# EAGLE schematic ir_transmitter (EAGLE 6.1)
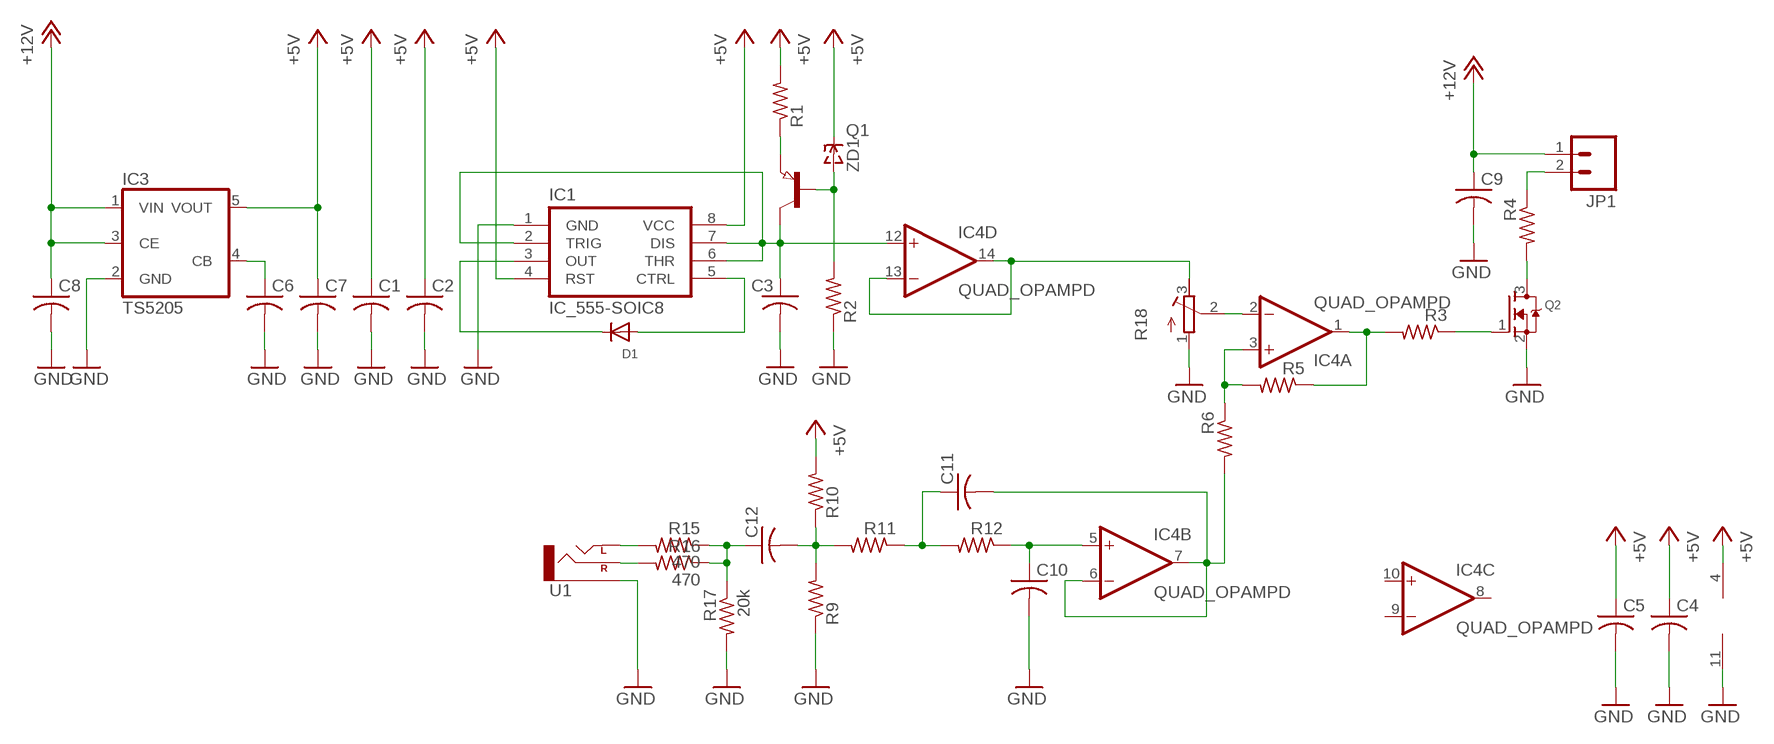
[diagram p0: schematic, sheet 1]

## Parts
C1  C-USC1206  [C1206]
C2  C-USC1206  [C1206]
C3  C-USC1206  [C1206]
C4  C-USC1206  [C1206]
C5  C-USC1206  [C1206]
C6  C-USC1206  [C1206]
C7  C-USC1206  [C1206]
C8  C-USC1206  [C1206]
C9  C-USC1206  [C1206]
C10  C-USC1206  [C1206]
C11  C-USC1206  [C1206]
C12  C-USC1206  [C1206]
D1  DIODESOD-123  [SOD-123]
IC1  IC_555-SOIC8  [SOIC-8]
IC3  TS5205  [SOT25]
IC4  QUAD_OPAMPD  [SO14]
JP1  M02POLAR  [MOLEX-1X2]
Q1  PNP-TRANSISTOR_SOT23  [SOT23]
Q2  MOSFET-NREFLOW  [SOT23]
R1  R-US_M1206  [M1206]
R2  R-US_M1206  [M1206]
R3  R-US_M1206  [M1206]
R4  R-US_M1206  [M1206]
R5  R-US_M1206  [M1206]
R6  R-US_M1206  [M1206]
R9  R-US_M1206  [M1206]
R10  R-US_M1206  [M1206]
R11  R-US_M1206  [M1206]
R12  R-US_M1206  [M1206]
R15  470  R-US_M1206  [M1206]
R16  470  R-US_M1206  [M1206]
R17  20k  R-US_M1206  [M1206]
R18  R-TRIMM3304W  [RTRIM3304W]
U1  AUDIO-JACKSMD  [STEREOJACK2.5MM_SMD]
ZD1  ZENERSOD-123  [SOD-123]

## Nets
+5V: C1.1 C2.1 C4.1 C5.1 C7.1 IC1.4(RST) IC1.8(VCC) IC3.5(VOUT) IC4.4(P:V+) R1.2 R10.2 ZD1.C
+12V: C8.1 C9.1 IC3.1(VIN) IC3.3(CE) JP1.1
CTRL: D1.A IC1.5(CTRL)
GND: C1.2 C2.2 C3.2 C4.2 C5.2 C6.2 C7.2 C8.2 C9.2 C10.2 IC1.1(GND) IC3.2(GND) IC4.11(P:V-) Q2.2(S) R2.1 R9.1 R17.2 R18.1(E) U1.5(SLEEVE)
N$1: IC4.1(A:OUT) R3.2 R5.1
N$2: Q2.1(G) R3.1
N$3: D1.C IC1.3(OUT)
N$4: Q2.3(D) R4.2
N$5: Q1.2(E) R1.1
N$6: C3.1 IC1.2(TRIG) IC1.6(THR) IC1.7(DIS) IC4.12(D:+IN) Q1.3(C)
N$7: Q1.1(B) R2.2 ZD1.A
N$8: JP1.2 R4.1
N$9: IC4.3(A:+IN) R5.2 R6.1
N$10: C6.1 IC3.4(CB)
N$12: IC4.13(D:-IN) IC4.14(D:OUT) R18.3(A)
N$13: C10.1 IC4.5(B:+IN) R12.1
N$14: C11.1 R11.1 R12.2
N$15: R15.2 U1.1(LEFT)
N$16: C11.2 IC4.6(B:-IN) IC4.7(B:OUT) R6.2
N$17: C12.2 R9.2 R10.1 R11.2
N$18: R16.2 U1.4(RIGHT)
N$22: C12.1 R15.1 R16.1 R17.1
N$23: IC4.2(A:-IN) R18.2(S)
Unconnected: IC4.8(C:OUT) IC4.9(C:-IN) IC4.10(C:+IN)

## Library data of the parts
C1-C12 = adafruit:C-US: CAPACITOR, American symbol
D1 = adafruit:DIODE: Diode SMADIODE - SMA Surface Mount Package 20V 1A Schottky Diode Digikey: 641-1014-6-ND DO-1N4148 - Through Hole Small Current Diode SOD-123 20V 1 A (.5mV Vf) Schottky Diode - Digikey: MBRX120TPMSCT-ND SOD-323 10V 570mA (.38mV Vf, 3ns) Schottky Diode - Digikey: ZLLS410CT-ND SOD-523 30V 30mA Schottky Diode (RB751S-40TE61) - Digikey: RB751S-40TE61CT-ND SOT23-R/W - SOT23 Package (R = Solder Paste/Reflow Ovens, W = Hand-Soldering) BAT54Film 40V 300mA - Digikey: 497-7162-1-ND
IC1 = dp_devices:IC_555: Classic 555 IC
IC3 = v-reg:TS5205: 150mA Low Noise LDO Voltage Regulator with Enable TSC [Taiwan Semiconductor Company, Ltd] Source: http://www.taiwansemi.com .. 5205_0409c.pdf
IC4 = adafruit:QUAD_OPAMP: OP AMP Standard quad package
JP1 = sparkfun:M02: Header 2 Standard 2-pin 0.1" header. Use with straight break away headers (SKU : PRT-00116), right angle break away headers (PRT-00553), swiss pins (PRT-00743), machine pins (PRT-00117), and female headers (PRT-00115). Molex polarized connector foot print use with SKU : PRT-08233 with associated crimp pins and housings.
Q1 = semicon-smd-ipc:PNP-TRANSISTOR_: PNP TRANSISTOR
Q2 = adafruit:MOSFET-N: N-Channel Mosfet 2N7002E - 60V 260mA SOT23 [Digikey: 2N7002ET1GOSTR-ND] - REEL BSH103 - 30V 850mA SOT23 [Digikey: 568-5013-1-ND]
R1-R6 R9-R12 R15-R17 = adafruit:R-US_: RESISTOR, American symbol
R18 = resistor:R-TRIMM: Trimm resistor
U1 = sparkfun:AUDIO-JACK: 3.5mm Audio Jack Simple 3.5mm common PCB mount audio jack. SKU: PRT-08032
ZD1 = dp_devices:ZENER: Zener Diode SOD-323